# EAGLE design AddMixShift (EAGLE 7.7.0)
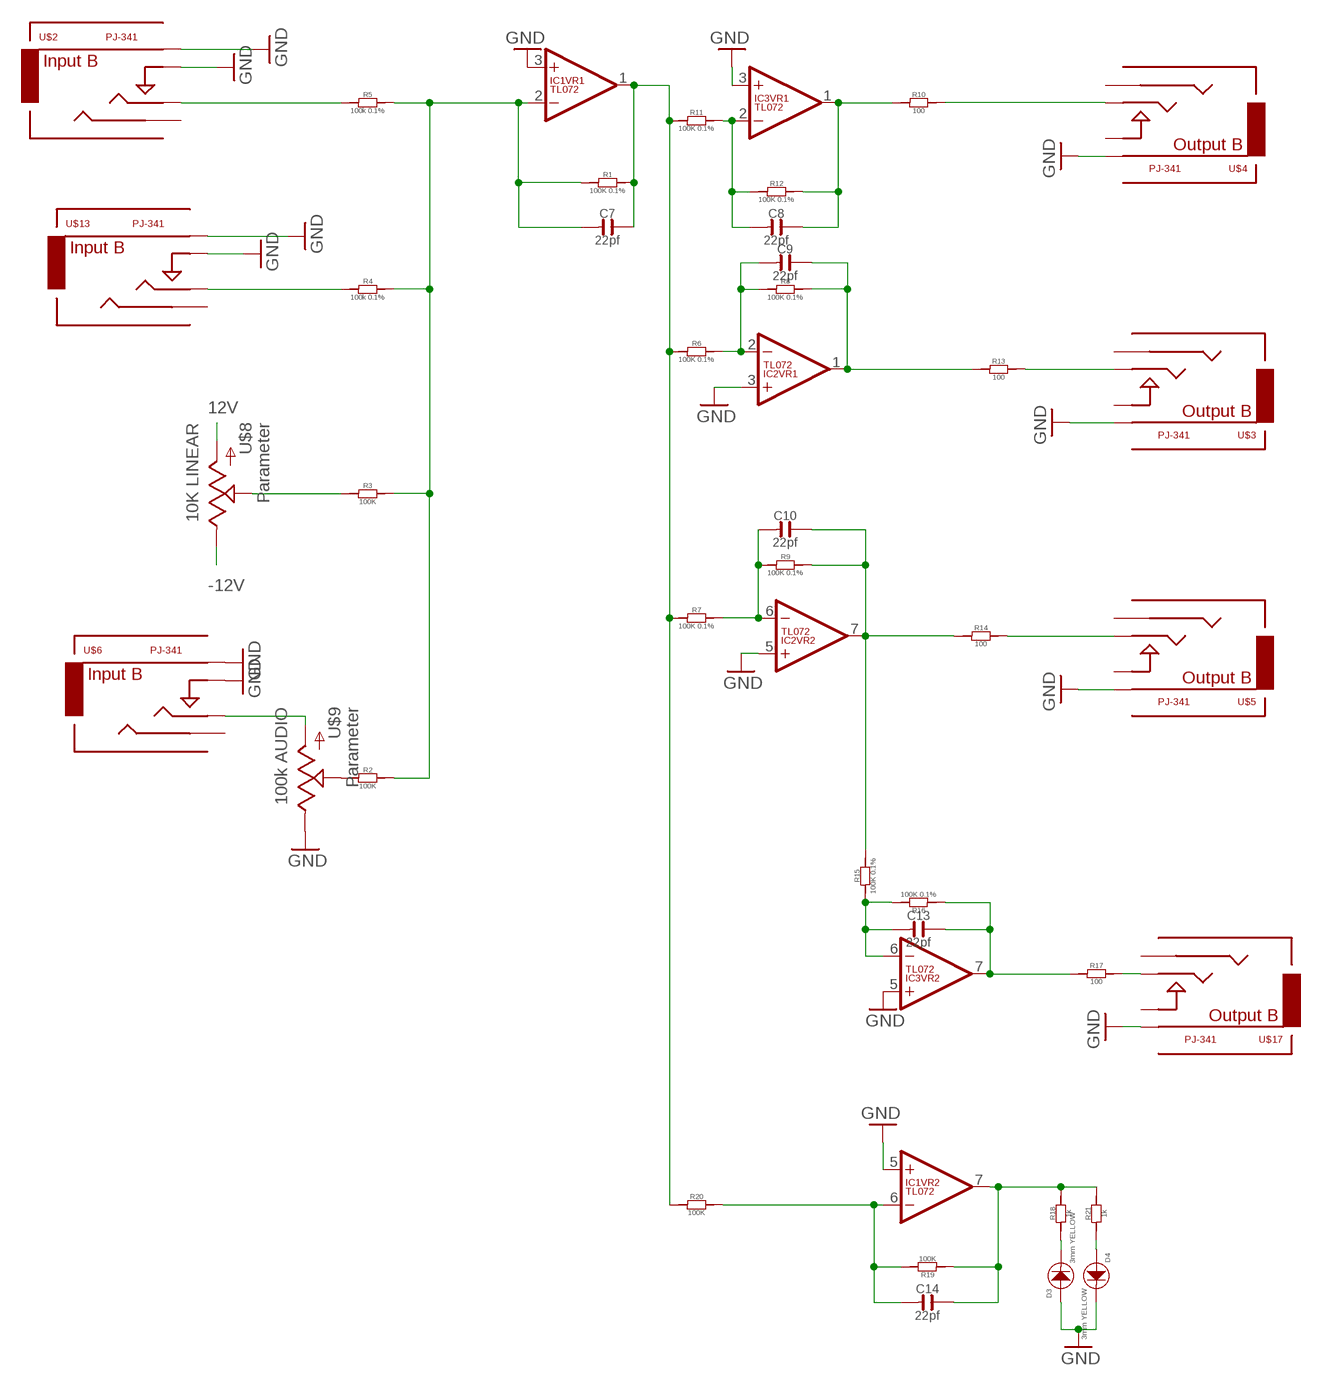
[diagram p0: schematic, sheet 1, part 1 of 2]
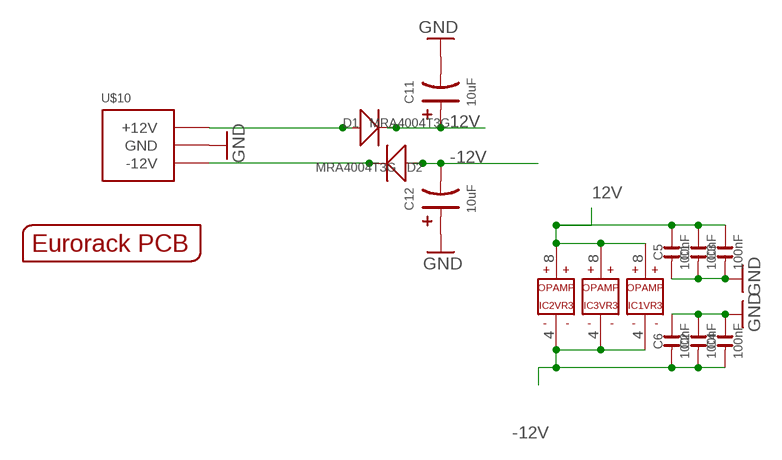
[diagram p1: schematic, sheet 1, part 2 of 2]

## Parts
C1  100nF  C-0603  [C0603]
C2  100nF  C-0603  [C0603]
C3  100nF  C-0603  [C0603]
C4  100nF  C-0603  [C0603]
C5  100nF  C-0603  [C0603]
C6  100nF  C-0603  [C0603]
C7  22pf  C-0603  [C0603]
C8  22pf  C-0603  [C0603]
C9  22pf  C-0603  [C0603]
C10  22pf  C-0603  [C0603]
C11  10uF  C-POLAR-A  [AVX-A]
C12  10uF  C-POLAR-A  [AVX-A]
C13  22pf  C-0603  [C0603]
C14  22pf  C-0603  [C0603]
D1  MRA4004T3G  D-SMA  [DO-214AC]
D2  MRA4004T3G  D-SMA  [DO-214AC]
D3  3mm YELLOW  LED3MM  [3MMLED]
D4  3mm YELLOW  LED3MM  [3MMLED]
IC1  TL072  [SO08]
IC2  TL072  [SO08]
IC3  TL072  [SO08]
R1  100K 0.1%  R-0603  [R0603]
R2  100K  R-0603  [R0603]
R3  100K  R-0603  [R0603]
R4  100k 0.1%  R-0603  [R0603]
R5  100k 0.1%  R-0603  [R0603]
R6  100K 0.1%  R-0603  [R0603]
R7  100K 0.1%  R-0603  [R0603]
R8  100K 0.1%  R-0603  [R0603]
R9  100K 0.1%  R-0603  [R0603]
R10  100  R-0603  [R0603]
R11  100K 0.1%  R-0603  [R0603]
R12  100K 0.1%  R-0603  [R0603]
R13  100  R-0603  [R0603]
R14  100  R-0603  [R0603]
R15  100K 0.1%  R-0603  [R0603]
R16  100K 0.1%  R-0603  [R0603]
R17  100  R-0603  [R0603]
R18  1k  R-0603  [R0603]
R19  100K  R-0603  [R0603]
R20  100K  R-0603  [R0603]
R21  1k  R-0603  [R0603]
U$1  EURORACK_PCB4HP  [EURORACK4HPPCB]
U$2  PJ-341  AUDIO-JACKINPUT  [3.5MM-JACK-SWITCH-13MM-INPUT]
U$3  PJ-341  AUDIO-JACKOUTPUT  [3.5MM-JACK-SWITCH-13MM-OUTPUT]
U$4  PJ-341  AUDIO-JACKOUTPUT  [3.5MM-JACK-SWITCH-13MM-OUTPUT]
U$5  PJ-341  AUDIO-JACKOUTPUT  [3.5MM-JACK-SWITCH-13MM-OUTPUT]
U$6  PJ-341  AUDIO-JACKINPUT  [3.5MM-JACK-SWITCH-13MM-INPUT]
U$8  10K LINEAR  POTZEPHPOT  [OG-POTS_ALPS_POT_VERTICAL]
U$9  100k AUDIO  POTZEPHPOT  [OG-POTS_ALPS_POT_VERTICAL]
U$10  POWER_SIMPLE  [2X05_SMT_HEADER]
U$13  PJ-341  AUDIO-JACKINPUT  [3.5MM-JACK-SWITCH-13MM-INPUT]
U$17  PJ-341  AUDIO-JACKOUTPUT  [3.5MM-JACK-SWITCH-13MM-OUTPUT]

## Nets
12V: C1.2 C3.2 C5.2 C11.+ D1.2(-) IC1.8(VR3:V+) IC2.8(VR3:V+) IC3.8(VR3:V+) U$8.P$3(A)
-12V: C2.1 C4.1 C6.1 C12.- D2.1(+) IC1.4(VR3:V-) IC2.4(VR3:V-) IC3.4(VR3:V-) U$8.P$1(E)
GND: C1.1 C2.2 C3.1 C4.2 C5.1 C6.2 C11.- C12.+ D3.+ D4.- IC1.3(VR1:+IN) IC1.5(VR2:+IN) IC2.3(VR1:+IN) IC2.5(VR2:+IN) IC3.3(VR1:+IN) IC3.5(VR2:+IN) U$2.RING@3(RING) U$2.SWITCH@3(SWITCH) U$3.RING@3(RING) U$4.RING@3(RING) U$5.RING@3(RING) U$6.RING@3(RING) U$6.SWITCH@3(SWITCH) U$9.P$1(E) U$10.3(GND) U$10.4(GND) U$10.5(GND) U$10.6(GND) U$10.7(GND) U$10.8(GND) U$13.RING@3(RING) U$13.SWITCH@3(SWITCH) U$17.RING@3(RING)
N$1: R2.1 U$9.P$2(S)
N$2: C8.2 IC3.1(VR1:OUT) R10.1 R12.2
N$4: U$6.TIP@3(TIP) U$9.P$3(A)
N$5: C9.1 IC2.2(VR1:-IN) R6.2 R8.1
N$6: R3.1 U$8.P$2(S)
N$7: C7.2 IC1.1(VR1:OUT) R1.2 R6.1 R7.1 R11.1 R20.1
N$8: C8.1 IC3.2(VR1:-IN) R11.2 R12.1
N$9: C10.1 IC2.6(VR2:-IN) R7.2 R9.1
N$11: C9.2 IC2.1(VR1:OUT) R8.2 R13.1
N$12: R4.1 U$13.TIP@3(TIP)
N$13: C10.2 IC2.7(VR2:OUT) R9.2 R14.1 R15.2
N$14: C7.1 IC1.2(VR1:-IN) R1.1 R2.2 R3.2 R4.2 R5.2
N$15: R13.2 U$3.TIP@3(TIP)
N$16: R14.2 U$5.TIP@3(TIP)
N$17: C13.1 IC3.6(VR2:-IN) R15.1 R16.2
N$18: C13.2 IC3.7(VR2:OUT) R16.1 R17.1
N$19: R17.2 U$17.TIP@3(TIP)
N$20: R5.1 U$2.TIP@3(TIP)
N$21: D4.+ R21.1
N$22: R10.2 U$4.TIP@3(TIP)
N$23: D3.- R18.1
N$24: C14.2 IC1.7(VR2:OUT) R18.2 R19.1 R21.2
N$25: C14.1 IC1.6(VR2:-IN) R19.2 R20.2
N$28 [heavypower]: D1.1(+) U$10.9(+12V) U$10.10(+12V)
N$64 [heavypower]: D2.2(-) U$10.1(-12V) U$10.2(-12V)
Unconnected: U$2.SECOND@3(SECOND) U$3.SECOND@3(SECOND) U$3.SWITCH@3(SWITCH) U$4.SECOND@3(SECOND) U$4.SWITCH@3(SWITCH) U$5.SECOND@3(SECOND) U$5.SWITCH@3(SWITCH) U$6.SECOND@3(SECOND) U$13.SECOND@3(SECOND) U$17.SECOND@3(SECOND) U$17.SWITCH@3(SWITCH)

## Library data of the parts
C1-C10 C13 C14 = OPL:C*
C11 C12 = EurorackModularParts:C-POLAR*
D1 D2 = OPL:D*: DIODE; MF: VISHAY; MPN: US1G-E3/5AT; OC_FARNELL: 9551824
D3 D4 = EurorackModularParts:LED*: LED
IC1-IC3 = EurorackModularParts:TL072
R1-R21 = OPL:R*
U$1 = EurorackModularParts:EURORACK_PCB
U$2 U$6 U$13 = EurorackModularParts:AUDIO-JACK: Switching Mono 3.5mm Audio Jack from Erthenvar.; DESC: Input B; MPN: PJ-341
U$3-U$5 U$17 = EurorackModularParts:AUDIO-JACK: Switching Mono 3.5mm Audio Jack from Erthenvar.; DESC: Output B; MPN: PJ-341
U$8 U$9 = EurorackModularParts:POT; DESC: Parameter
U$10 = EurorackModularParts:POWER_SIMPLE

## Net classes
0 default: width 0.254 mm
1 heavypower: width 0.381 mm

## Board
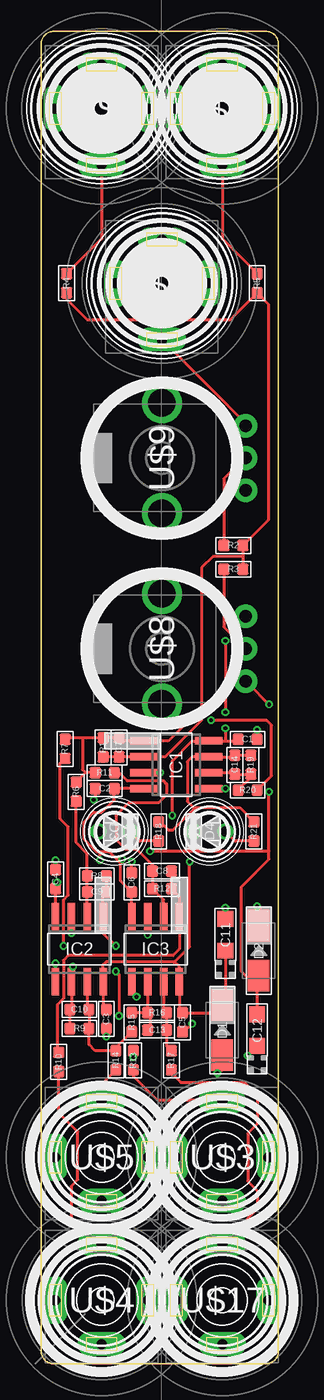
[diagram p2: board, top side]
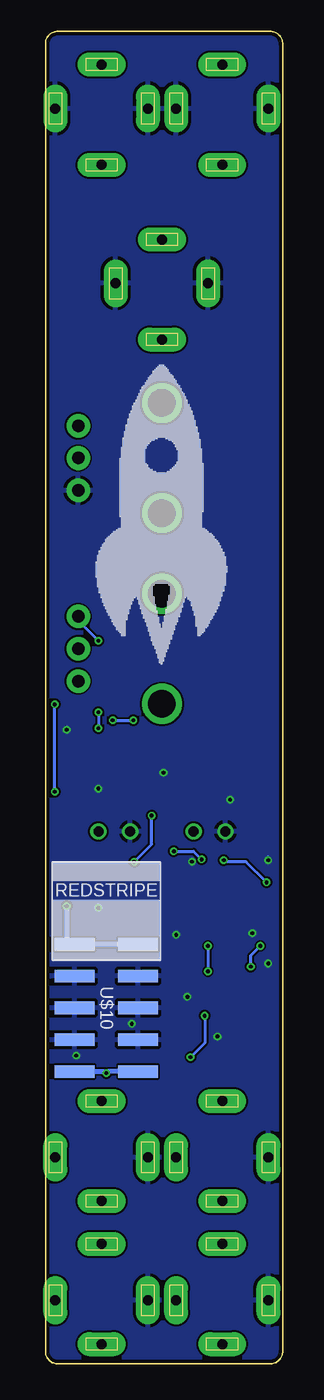
[diagram p3: board, bottom side, seen from below]

Size 18.98 x 106.5 mm. Coordinates in mm from the lower left corner, seen from the top.
Copper layers (1*16): Top 0.035mm / dielectric 1.5mm / Bottom 0.035mm
Design rules "ITEADstudio_DRC": minimum track width 6mil, minimum drill 12mil, track to track 6mil, track to pad 6mil, pad to pad 6mil, via to via 6mil, smd to smd 0mil, copper to edge 10mil, drill to drill 10mil, minimum pad ring 10mil, minimum via ring 6mil, stop-mask expansion 2mil, vias tented up to drill 100mil, thermal gap 10mil

### Footprints (pad centres in the part's own frame; a part is rotated, then mirrored left to right if it is on the bottom)
C0603 = smd 0.889 x 0.889: 1 -0.762,0; 2 0.762,0
AVX-A = smd 1.27 x 1.27: + -1.27,0; - 1.27,0
DO-214AC = smd 2.5 x 1.7: 1 -2,0; 2 2,0
3MMLED = drill 0.8: + -1.27,0; - 1.27,0
SO08 = smd 0.6 x 2.2: 1 -1.905,-2.6; 2 -0.635,-2.6; 3 0.635,-2.6; 4 1.905,-2.6; 5 1.905,2.6; 6 0.635,2.6; 7 -0.635,2.6; 8 -1.905,2.6
R0603 = smd 0.889 x 0.889: 1 -0.762,0; 2 0.762,0
3.5MM-JACK-SWITCH-13MM-INPUT = drill 0.8 pad 1.93 long: RING@3 -3.7,0; SECOND@3 0,-3.5; SWITCH@3 3.7,0; TIP@3 0,4.5
3.5MM-JACK-SWITCH-13MM-OUTPUT = drill 0.8 pad 1.93 long: RING@3 -3.7,0; SECOND@3 0,-3.5; SWITCH@3 3.7,0; TIP@3 0,4.5
OG-POTS_ALPS_POT_VERTICAL = drill 1 pad 1.88: P$1 -2.58,-6.7; P$2 0,-6.7; P$3 2.58,-6.7 | drill 2.2 pad 3.175: P$4 4.4,0; P$5 -4.4,0
2X05_SMT_HEADER = smd 1 x 3.17: 1 -5.08,-2.54; 2 -5.08,2.54; 3 -2.54,-2.54; 4 -2.54,2.54; 5 0,-2.54; 6 0,2.54; 7 2.54,-2.54; 8 2.54,2.54; 9 5.08,-2.54; 10 5.08,2.54

### Placement (x,y rotation side)
C1  16.52,49.91 180 top
C2  5.09,45.97 180 top
C3  5.21,27.56 90 top
C4  1.15,38.73 90 top
C5  11.31,27.3 90 top
C6  7.25,38.48 90 top
C7  6.23,49.28 90 top
C8  9.66,39.37 0 top
C9  4.45,37.72 0 top
C10  3.06,28.32 0 top
C11  14.74,34.29 90 top
C12  17.28,26.67 90 top
C13  9.28,26.67 0 top
C14  15.5,47.88 90 top
D1  14.49,26.67 90 top
D2  17.41,33.02 90 top
D3  5.85,42.55 0 top
D4  13.47,42.55 180 top
IC1  10.8,47.88 270 top
IC2  3.06,33.15 180 top
IC3  9.15,33.15 180 top
R1  4.96,49.28 90 top
R2  15.38,65.41 0 top
R3  15.38,63.5 0 top
R4  2.04,86.36 270 top
R5  17.28,86.36 270 top
R6  2.8,45.72 270 top
R7  1.91,49.15 270 top
R8  4.45,38.99 0 top
R9  3.06,26.8 0 top
R10  1.41,24.13 270 top
R11  5.09,47.24 0 top
R12  9.66,37.97 0 top
R13  7.37,24.26 270 top
R14  5.98,24.26 270 top
R15  7.25,27.3 270 top
R16  9.28,28.07 180 top
R17  10.42,24.26 270 top
R18  9.41,42.55 90 top
R19  16.77,47.88 270 top
R20  16.52,45.85 180 top
R21  17.03,42.55 90 top
U$1  -0.5,0 0 top
U$2  14.49,100.33 180 top
U$3  14.49,16.51 0 top
U$4  4.83,5.08 0 top
U$5  4.83,16.51 0 top
U$6  9.66,86.36 180 top
U$8  9.66,57.15 90 top
U$9  9.66,72.39 90 top
U$10  14.11,28.45 270 bottom
U$11  TINRS_ARTWORKROCKET  [TINRS_ROCKET]  9.79,72.64 90 bottom
U$13  4.83,100.33 180 top
U$17  14.49,5.08 0 top

### Tracks (layer width: path | path; a pad name or v marks a point on that pad's centre or on a via)
12V  (via drill 0.3)
  Top 0.254: C3.2 4.96,28.57 IC2.8 4.96,31.88 5.21,32.13 10.61,32.13 | 14.74,49.78 IC1.8 12.07,49.78 10.49,48.2 v10.49,43.81 | 14.74,49.78 15.63,49.78 C1.2 | C11.+ 14.74,28.92 D1.2 13.88,28.07 C5.2 11.06,28.32 IC3.8 11.06,31.75 10.68,32.13 10.61,32.13 | v14.74,50.8 14.74,49.78 | v14.74,57.78 v14.74,52.07 | v11.88,40.13 11.88,33.34 10.61,32.07 10.61,32.13
  Bottom 0.254: v14.74,52.07 v14.74,50.8 | v14.74,57.78 16.64,59.69 U$8.P$3 | v10.49,43.81 10.49,41.53 v11.88,40.13
-12V  (via drill 0.3)
  Top 0.254: IC3.4 C6.1 6.36,38.61 6.36,40.01 6.1,40.26 | IC2.4 C4.1 v1.28,38.48 | IC1.4 C2.1 5.85,45.09 4.83,44.07 4.2,44.07 3.44,43.31 3.44,41.91 4.45,40.89 4.71,40.89 | C12.- 17.28,30.89 | 17.28,30.89 D2.1 | 17.28,30.89 16.49,30.89 16.01,31.37 16.01,38.1 18.23,40.32 18.23,40.96 | 6.1,40.26 5.47,40.89 4.71,40.89 | v4.71,40.26 4.71,40.89 | v18.23,52.7 16.64,54.29 U$8.P$1 | 18.23,40.96 v18.23,45.72 | v6.49,40.32 6.17,40.32 6.1,40.26 | 18.23,40.96 v8.71,40.96
  Bottom 0.254: v1.28,38.48 2.93,40.13 4.58,40.13 v4.71,40.26 | v18.23,45.72 v18.23,52.7 | v6.49,40.32 7.12,40.96 v8.71,40.96
GND  (via drill 0.3)
  Top 0.254: IC1.3 v9.53,47.24 | IC1.5 v14.74,45.97 | C4.2 v1.15,40.26 | C6.2 v7.25,40.13 | IC3.3 v8.52,34.29 | C11.- v14.74,36.45 | IC3.5 7.25,29.72 v7.63,29.34 | C3.1 v5.21,26.16 | IC2.5 v1.15,32 | C5.1 11.44,26.54 v12.07,27.18 | C12.+ v16.52,24.64 | C2.2 4.33,45.21 v4.2,45.09 | C1.1 v17.28,50.67 | IC2.3 v2.42,34.42
  Bottom 0.254: v9.53,47.24 9.79,47.24 | v14.74,45.97 14.61,45.97 | v1.15,40.26 1.15,40.51 | v7.25,40.13 7.25,40.39 | v8.52,34.29 8.52,34.16 | v14.74,36.45 14.74,36.7 | v7.63,29.34 7.76,29.21 | v5.21,26.16 5.34,26.29 | v1.15,32 1.15,32.13 | v12.07,27.18 12.33,27.18 | v16.52,24.64 16.26,24.64 | v4.2,45.09 4.33,44.96 | v17.28,50.67 17.28,50.93 | v2.42,34.42 2.42,34.16
  pour Bottom: 19.57,106.68 -0.75,106.68 -0.5,0 19.82,0
N$1
  Top 0.254: U$9.P$2 16.26,72.39 14.61,70.74 R2.1
N$2
  Top 0.254: R10.1 1.28,25.02 1.28,28.7 1.79,29.21 1.79,32.26 2.17,32.64 10.55,32.64 11.06,33.15 IC3.1 11.06,37.34 R12.2 C8.2
N$4
  Top 0.254: U$9.P$3 16.36,75.16 U$6.TIP@3
N$5
  Top 0.254: IC2.2 C9.1 R8.1 3.69,40.77 2.8,41.66 R6.2
N$6
  Top 0.254: R3.1 14.61,58.9 U$8.P$2
N$7  (via drill 0.3)
  Top 0.254: 3.31,50.04 R1.2 C7.2 6.49,49.78 IC1.1 10.17,49.78 11.82,51.44 v11.95,51.44 | 3.31,50.04 2.04,50.04 R7.1 | R11.1 3.56,47.24 | 3.56,47.24 R6.1 | R20.1 18.42,46.99 18.42,51.05 18.04,51.44 v13.6,51.44 | 3.31,50.04 3.31,47.5 3.56,47.24
  Bottom 0.254: v13.6,51.44 v11.95,51.44
N$8
  Top 0.254: IC3.2 9.79,37.08 R12.1 C8.1 8.9,39.88 7.63,41.15 6.74,41.15 5.98,41.91 5.98,43.81 6.99,44.83 9.41,44.83 10.04,45.47 10.04,46.35 9.79,46.61 6.87,46.61 6.23,47.24 R11.2
N$9  (via drill 0.3)
  Top 0.254: R9.1 C10.1 2.42,28.45 IC2.6 2.42,31.62 v2.55,31.75 | v1.79,33.4 1.79,37.08 2.17,37.47 2.17,42.93 1.53,43.56 1.53,48.01 R7.2
  Bottom 0.254: v2.55,31.75 2.55,32.64 v1.79,33.4
N$11  (via drill 0.3)
  Top 0.254: R8.2 C9.2 4.96,37.47 IC2.1 4.96,34.42 v5.98,33.4 | v5.98,31.37 6.23,31.11 v6.23,27.81 | v7.37,24.51 R13.1
  Bottom 0.254: v5.98,33.4 v5.98,31.37 | v6.23,27.81 6.23,25.65 v7.37,24.51
N$12
  Top 0.254: U$13.TIP@3 4.83,89.92 R4.1
N$13
  Top 0.254: IC2.7 3.69,28.45 C10.2 R9.2 3.82,25.53 4.33,25.02 R14.1 5.98,25.27 R15.2
N$14
  Top 0.254: R1.1 C7.1 IC1.2 9.91,48.51 12.84,51.44 12.84,63.63 13.72,64.52 16.14,64.52 | R4.2 2.04,85.09 3.69,83.44 15.12,83.44 R5.2 18.17,84.71 18.17,67.44 R2.2 16.14,64.52 | 16.14,64.52 R3.2
N$15
  Top 0.254: R13.2 7.37,22.99 9.28,21.08 14.41,21.08 U$3.TIP@3
N$16
  Top 0.254: U$5.TIP@3 4.83,22.35 R14.2
N$17
  Top 0.254: IC3.6 R16.2 | R16.2 R15.1 | C13.1 8.71,26.67 8.71,27.94 R16.2
N$18
  Top 0.254: IC3.7 9.79,28.32 R16.1 C13.2 10.04,25.4 R17.1
N$19
  Top 0.254: R17.2 10.42,23.24 11.18,22.48 16.26,22.48 17.28,21.46 17.28,19.18 16.52,18.41 16.52,14.61 17.28,13.84 17.28,12.37 U$17.TIP@3
N$20
  Top 0.254: U$2.TIP@3 14.49,89.92 R5.1
N$21
  Top 0.254: R21.1 15.5,41.78 D4.+
N$22
  Top 0.254: U$4.TIP@3 4.02,9.58 2.42,11.18 2.42,14.22 2.93,14.73 2.93,18.54 1.41,20.07 R10.2
N$23
  Top 0.254: R18.1 7.88,41.78 D3.-
N$24
  Top 0.254: IC1.7 15.38,48.51 C14.2 R19.1 | IC1.7 12.71,48.51 | R21.2 15.88,44.45 12.33,44.45 12.26,44.39 | R18.2 9.53,43.31 10.17,42.67 10.55,42.67 12.26,44.39 | IC1.7 12.07,48.51 11.69,48.13 11.69,44.96 12.26,44.39
N$25
  Top 0.254: IC1.6 15.38,47.24 C14.1 R19.2 16.77,46.86 R20.2
N$28  (via drill 0.3)
  Top 0.381: D1.1 14.49,23.62 v14.11,23.24
  Bottom 0.381: U$10.10 13.98,23.37 v14.11,23.24 14.23,23.37 U$10.9
N$64  (via drill 0.3)
  Top 0.381: D2.2 17.44,36.42 v17.28,36.58
  Bottom 0.381: v17.28,36.58 17.28,33.78 U$10.1 U$10.2